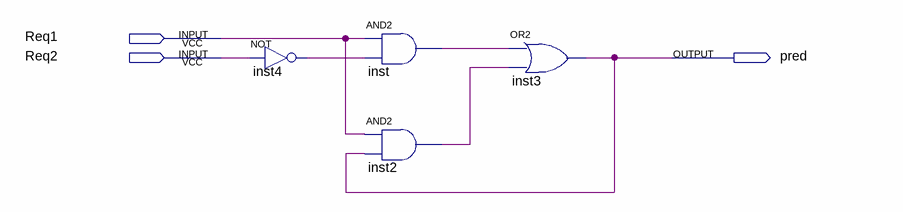
[diagram p0: schematic sheet]
// Quartus schematic arbitr.bdf as structural Verilog: 4 symbols, 3 pins
module arbitr (
  input  Req1,
  input  Req2,
  output pred
);

  wire inst2_out, inst4_out, inst_out;

  not inst4 (inst4_out, Req2);
  and inst (inst_out, Req1, inst4_out);
  and inst2 (inst2_out, Req1, pred);
  or inst3 (pred, inst_out, inst2_out);
endmodule
